# EAGLE design Goggles (EAGLE 5.11)
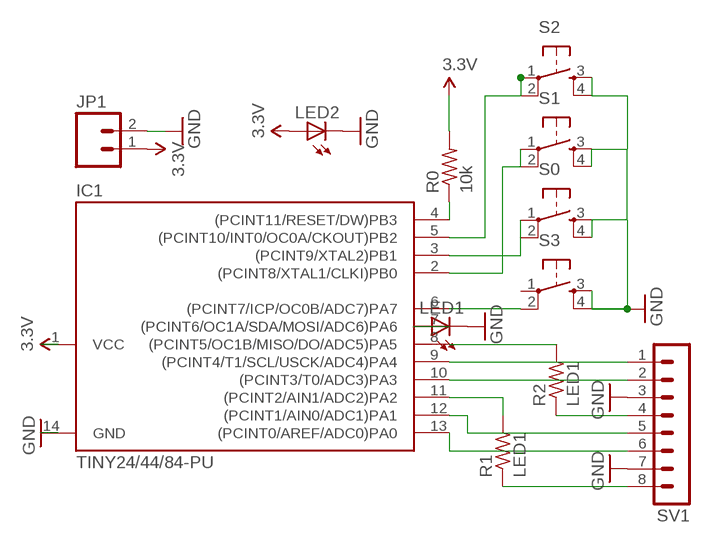
[diagram p0: schematic, sheet 1]

## Parts
IC1  TINY24/44/84-PU  [DIL14]
JP1  M02  [1X02_LONGPADS]
LED1  LED3MM  [LED3MM]
LED2  LED3MM  [LED3MM]
R0  10k  R-US_0207/7  [0207/7]
R1  LED1  R-US_0207/7  [0207/7]
R2  LED1  R-US_0207/7  [0207/7]
S0  TAC_SWITCHPTH  [TACTILE-PTH]
S1  TAC_SWITCHPTH  [TACTILE-PTH]
S2  TAC_SWITCHPTH  [TACTILE-PTH]
S3  TAC_SWITCHPTH  [TACTILE-PTH]
SV1  MA08-1  [MA08-1]

## Nets
3.3V: IC1.1(VCC) JP1.1 LED2.A R0.2
GND: IC1.14(GND) JP1.2 LED1.K(C) LED2.K(C) S0.3 S0.4 S1.3 S1.4 S2.3 S2.4 S3.3 S3.4 SV1.3 SV1.7
MISO: IC1.8((PCINT5/OC1B/MISO/DO/ADC5)PA5) R2.2
N$1: IC1.7((PCINT6/OC1A/SDA/MOSI/ADC6)PA6) LED1.A
N$2: IC1.6((PCINT7/ICP/OC0B/ADC7)PA7) S3.2
N$3: IC1.11((PCINT2/AIN1/ADC2)PA2) R1.2
N$4: R2.1 SV1.4
N$5: R1.1 SV1.8
N$6: IC1.13((PCINT0/AREF/ADC0)PA0) SV1.6
N$7: IC1.12((PCINT1/AIN0/ADC1)PA1) SV1.5
N$9: IC1.10((PCINT3/T0/ADC3)PA3) SV1.2
N$10: IC1.2((PCINT8/XTAL1/CLKI)PB0) S1.1 S1.2
N$11: IC1.5((PCINT10/INT0/OC0A/CKOUT)PB2) S2.1 S2.2
N$13: IC1.3((PCINT9/XTAL2)PB1) S0.1 S0.2
RESET: IC1.4((PCINT11/RESET/DW)PB3) R0.1
SCK: IC1.9((PCINT4/T1/SCL/USCK/ADC4)PA4) SV1.1
Unconnected: S3.1

## Library data of the parts
IC1 = avr-6:TINY24/44/84
JP1 = SparkFun:M02: Header 2 Standard 2-pin 0.1" header. Use with straight break away headers (SKU : PRT-00116), right angle break away headers (PRT-00553), swiss pins (PRT-00743), machine pins (PRT-00117), and female headers (PRT-00115). Molex polarized connector foot print use with SKU : PRT-08233 with associated crimp pins and housings.
LED1 LED2 = SparkFun:LED: LEDs Standard schematic elements and footprints for 5mm, 3mm, 1206, and 0603 sized LEDs. 5mm - Spark Fun Electronics SKU : COM-00529 (and others)
R0 R1 R2 = adafruit:R-US_: RESISTOR, American symbol
S0 S1-S3 = SparkFun:TAC_SWITCH: Momentary Switch Button commonly used for reset or general input. Spark Fun Electronics SKU : COM-00097
SV1 = con-lstb:MA08-1: PIN HEADER

## Board
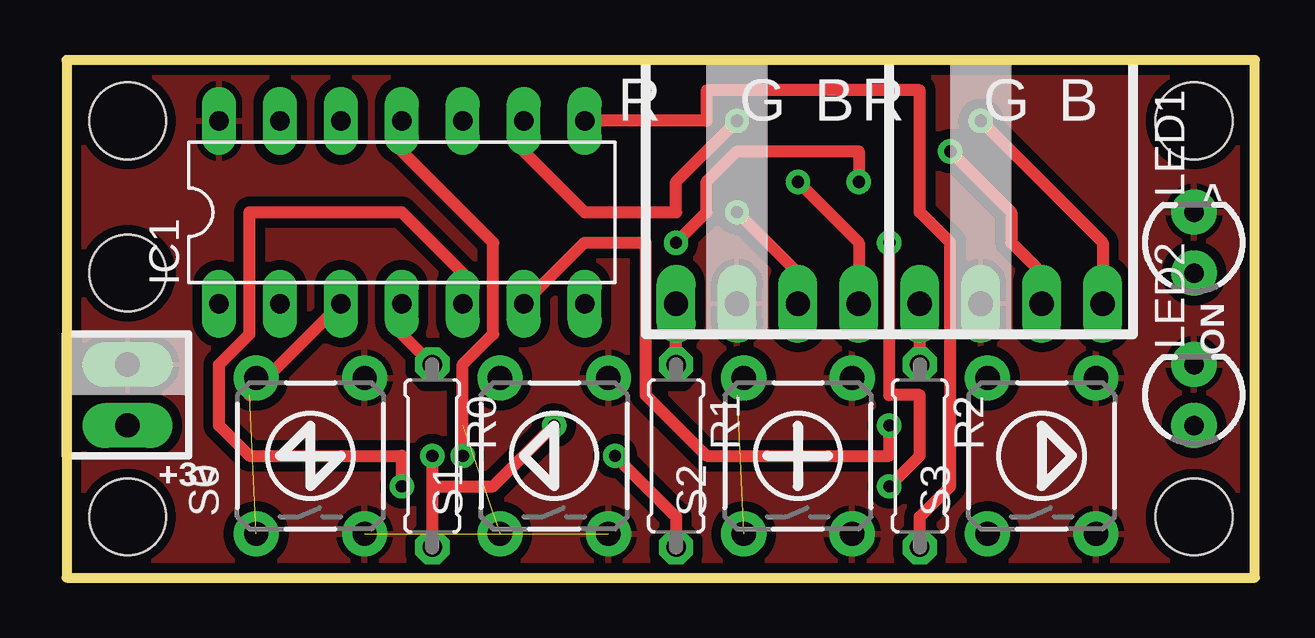
[diagram p1: board, top side]
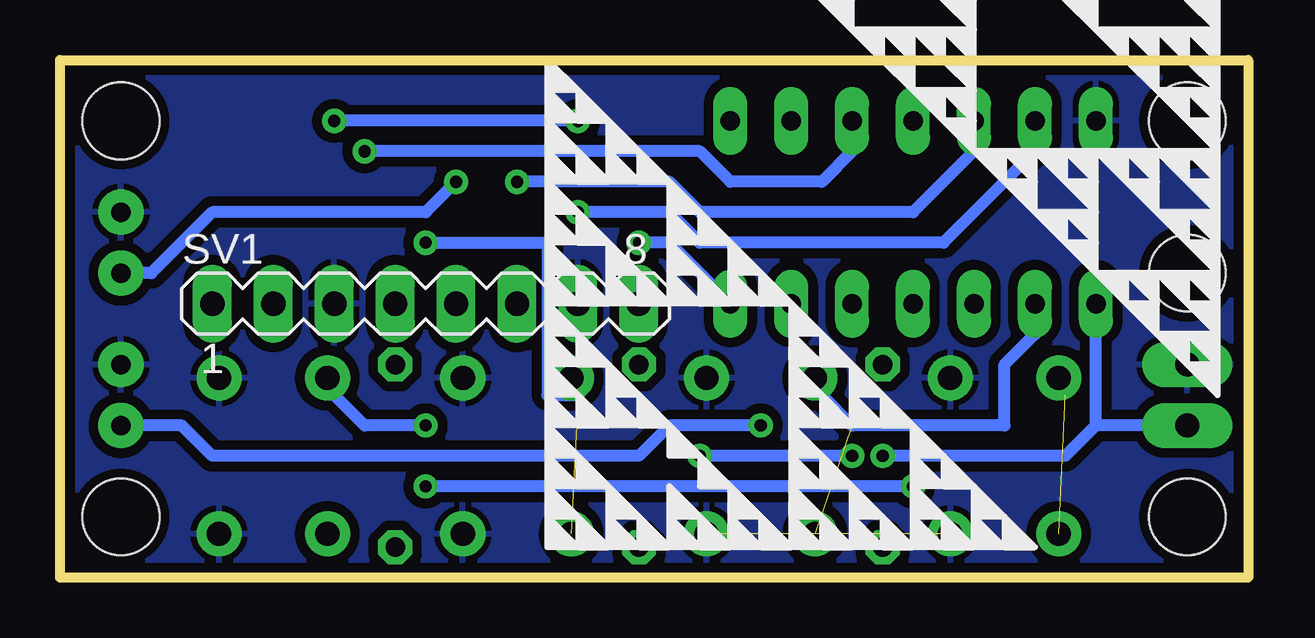
[diagram p2: board, bottom side, seen from below]

Size 49.53 x 21.59 mm. Coordinates in mm from the lower left corner, seen from the top.
Outline: 0,0 49.53,0 49.53,21.59 0,21.59 0,0
Copper layers (1*16): Top 0.035mm / dielectric 1.5mm / Bottom 0.035mm
Design rules "SparkFun *": minimum track width 10mil, minimum drill 20mil, track to track 8mil, track to pad 8mil, pad to pad 8mil, via to via 8mil, smd to smd 8mil, copper to edge 10mil, drill to drill 8mil, minimum pad ring 12mil, minimum via ring 10mil, stop-mask expansion 4mil, vias tented up to drill 25mil, thermal gap 10mil
Holes 3.2 mm at 2.54,19.05 46.99,19.05 2.54,2.54 46.99,2.54 2.54,12.7

### Footprints (pad centres in the part's own frame; a part is rotated, then mirrored left to right if it is on the bottom)
DIL14 = drill 0.813 long: 1 -7.62,-3.81; 2 -5.08,-3.81; 3 -2.54,-3.81; 4 0,-3.81; 5 2.54,-3.81; 6 5.08,-3.81; 7 7.62,-3.81; 8 7.62,3.81; 9 5.08,3.81; 10 2.54,3.81; 11 0,3.81; 12 -2.54,3.81; 13 -5.08,3.81; 14 -7.62,3.81
1X02_LONGPADS = drill 1.016 pad 1.88 long: 1 0,0; 2 2.54,0
LED3MM = drill 0.813 pad 1.88 round: A -1.27,0; K 1.27,0
0207/7 = drill 0.813 octagon: 1 -3.81,0; 2 3.81,0
TACTILE-PTH = drill 1.016 pad 1.88 round: 1 -3.251,2.261; 2 3.251,2.261; 3 -3.251,-2.261; 4 3.251,-2.261
MA08-1 = drill 1.016 long: 1 -8.89,0; 2 -6.35,0; 3 -3.81,0; 4 -1.27,0; 5 1.27,0; 6 3.81,0; 7 6.35,0; 8 8.89,0

### Placement (x,y rotation side)
IC1  13.97,15.24 0 top
JP1  2.54,6.35 90 top
LED1  46.99,13.97 90 top
LED2  46.99,7.62 90 top
R0  15.24,5.08 270 top
R1  25.4,5.08 270 top
R2  35.56,5.08 270 top
S0  10.16,5.08 90 top
S1  20.32,5.08 90 top
S2  30.48,5.08 90 top
S3  40.64,5.08 90 top
SV1  34.29,11.43 0 bottom

### Tracks (layer width: path | path; a pad name or v marks a point on that pad's centre or on a via)
3.3V  (via drill 0.51)
  Top 0.508: v15.24,5.08 15.24,3.81 | 15.24,3.81 R0.2 | v20.32,6.35 17.78,3.81 15.24,3.81
  Bottom 0.508: 6.35,6.35 IC1.1 | JP1.1 6.35,6.35 | v15.24,5.08 7.62,5.08 6.35,6.35 | LED2.A 44.45,6.35 43.18,5.08 25.4,5.08 24.13,6.35 v20.32,6.35
GND  (1 unrouted)
  pour Bottom (isolate 0.406): 0,0 0,21.59 49.53,21.59 49.53,0
  pour Top (isolate 0.406): 0,0 49.53,0 49.53,21.59 0,21.59
MISO
  Top 0.508: IC1.8 26.67,19.05 26.67,20.32 35.56,20.32 35.56,15.24 36.83,13.97 36.83,3.81 35.56,2.54 R2.2
N$1  (via drill 0.51)
  Top 0.508: v25.4,13.97 26.67,15.24 26.67,16.51 27.94,17.78 33.02,17.78 v33.02,16.51
  Bottom 0.508: IC1.7 24.13,13.97 v25.4,13.97 | v33.02,16.51 34.29,15.24 43.18,15.24 45.72,12.7 LED1.A
N$2  (via drill 0.51)
  Top 0.508: IC1.6 21.59,13.97 24.13,13.97 24.13,7.62 26.67,5.08 34.29,5.08 v34.29,6.35
  Bottom 0.508: v34.29,6.35 36.83,6.35 38.1,7.62 S3.2
N$3  (via drill 0.51)
  Top 0.508: R1.2 25.4,2.54 v22.86,5.08 | v16.51,5.08 16.51,8.89 17.78,10.16 17.78,13.97 13.97,17.78 IC1.11
  Bottom 0.508: v16.51,5.08 v22.86,5.08
N$4
  Top 0.508: R2.1 SV1.4
N$5
  Top 0.508: R1.1 SV1.8
N$6  (via drill 0.51)
  Top 0.508: v27.94,15.24 30.48,12.7 SV1.6
  Bottom 0.508: IC1.13 8.89,17.78 12.7,13.97 22.86,13.97 24.13,15.24 v27.94,15.24
N$7  (via drill 0.51)
  Top 0.508: v30.48,16.51 33.02,13.97 SV1.5
  Bottom 0.508: IC1.12 11.43,17.78 13.97,15.24 22.86,15.24 24.13,16.51 v30.48,16.51
N$9  (via drill 0.51)
  Top 0.508: v36.83,17.78 39.37,15.24 39.37,13.97 40.64,12.7 SV1.2
  Bottom 0.508: IC1.10 16.51,17.78 17.78,16.51 21.59,16.51 22.86,17.78 v36.83,17.78
N$10  (1 unrouted)
  Bottom 0.508: IC1.2 8.89,10.16 10.16,8.89 10.16,6.35 16.51,6.35 17.78,7.62 S1.2
N$11  (via drill 0.51)  (1 unrouted)
  Top 0.508: IC1.5 16.51,12.7 13.97,15.24 7.62,15.24 7.62,10.16 6.35,8.89 6.35,6.35 7.62,5.08 13.97,5.08 v13.97,3.81 | v34.29,3.81 35.56,5.08 35.56,7.62 34.29,7.62 v34.29,13.97
  Bottom 0.508: v13.97,3.81 v34.29,3.81 | v34.29,13.97 29.21,13.97 29.21,7.62 27.94,7.62 S2.2
N$13  (1 unrouted)
  Top 0.508: IC1.3 7.62,7.62 S0.2
RESET
  Top 0.508: R0.1 13.97,10.16 IC1.4
SCK  (via drill 0.51)
  Top 0.508: IC1.9 19.05,17.78 21.59,15.24 25.4,15.24 25.4,16.51 v27.94,19.05 | v38.1,19.05 43.18,13.97 SV1.1
  Bottom 0.508: v27.94,19.05 v38.1,19.05

### Text on the board
tPlace: R | G | B | R | G | B | > | ON | +3v